# EAGLE design STM32F303CBT6_BTN8962TA_V1_0 (EAGLE 9.5.2)
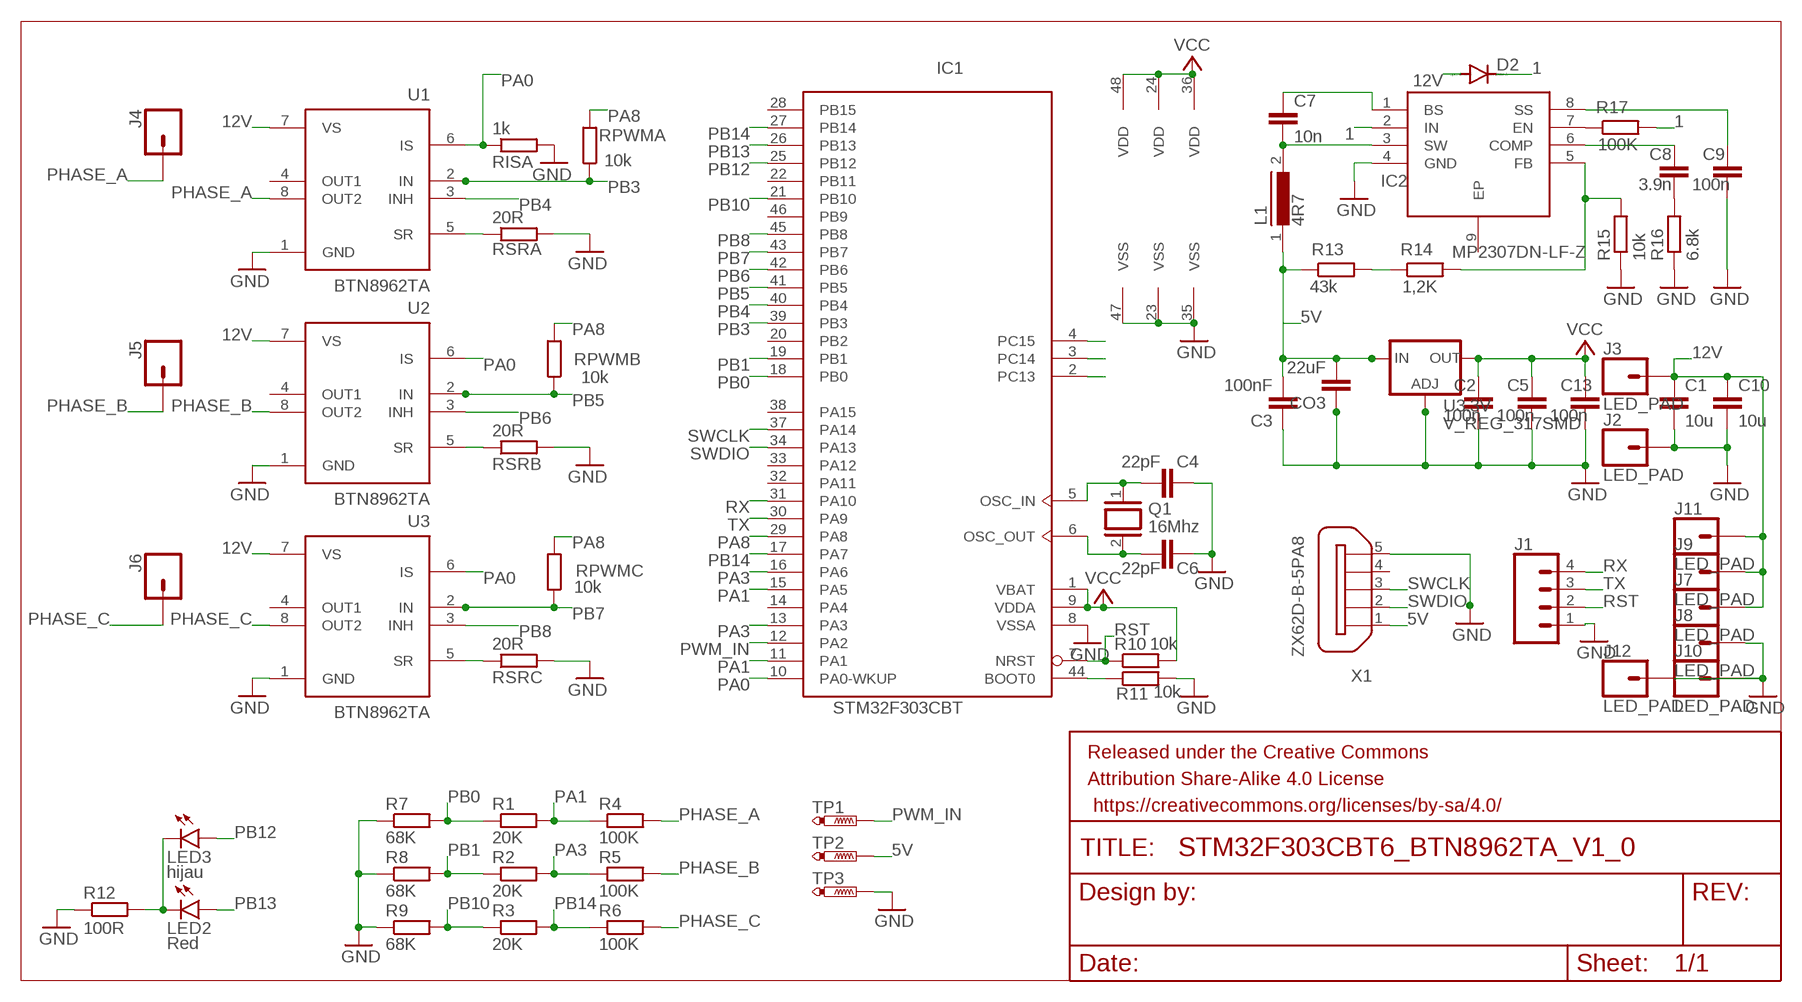
[diagram p0: schematic, sheet 1]

## Parts
C1  10u  C-EUC1206K  [C1206K]
C2  100n  C-EUC0603K  [C0603K]
C3  100nF  C-EUC0805  [C0805]
C4  22pF  C-EUC0805  [C0805]
C5  100n  C-EUC0603K  [C0603K]
C6  22pF  C-EUC0805  [C0805]
C7  10n  C-EUC0603K  [C0603K]
C8  3.9n  C-EUC0603K  [C0603K]
C9  100n  C-EUC0603K  [C0603K]
C10  10u  C-EUC1206K  [C1206K]
C13  100n  C-EUC0603K  [C0603K]
CO3  22uF  C-EUC0805  [C0805]
D2  DIODE-SOD80C  [SOD80C]
FRAME1  FRAME-LETTER  [CREATIVE_COMMONS]
IC1  STM32F303CBT  [LQFP48]
IC2  MP2307DN-LF-Z  [SOIC127P600X170-9N]
J1  CONN_04SMD2  [JST04_1MM_RA]
J2  LED_PAD  [CIRCULARPAD]
J3  LED_PAD  [CIRCULARPAD]
J4  CONN_01SNAP-MALE  [SNAP-MALE]
J5  CONN_01SNAP-MALE  [SNAP-MALE]
J6  CONN_01SNAP-MALE  [SNAP-MALE]
J7  LED_PAD  [CIRCULARPAD]
J8  LED_PAD  [CIRCULARPAD]
J9  LED_PAD  [CIRCULARPAD]
J10  LED_PAD  [CIRCULARPAD]
J11  LED_PAD  [CIRCULARPAD]
J12  LED_PAD  [CIRCULARPAD]
L1  4R7  DR74  [DR74]
LED2  Red  LEDCHIPLED_0805  [CHIPLED_0805]
LED3  hijau  LEDCHIPLED_0805  [CHIPLED_0805]
Q1  16Mhz  XTAL/S  [QS]
R1  20K  R-EU_R0805  [R0805]
R2  20K  R-EU_R0805  [R0805]
R3  20K  R-EU_R0805  [R0805]
R4  100K  R-EU_R0805  [R0805]
R5  100K  R-EU_R0805  [R0805]
R6  100K  R-EU_R0805  [R0805]
R7  68K  R-EU_R0805  [R0805]
R8  68K  R-EU_R0805  [R0805]
R9  68K  R-EU_R0805  [R0805]
R10  10k  R-EU_R0603  [R0603]
R11  10k  R-EU_R0603  [R0603]
R12  100R  R-EU_R0603  [R0603]
R13  43k  R-EU_R0603  [R0603]
R14  1,2K  R-EU_R0603  [R0603]
R15  10k  R-EU_R0603  [R0603]
R16  6.8k  R-EU_R0603  [R0603]
R17  100K  R-EU_R0603  [R0603]
RISA  1k  R-EU_R0805  [R0805]
RPWMA  10k  R-EU_R0805  [R0805]
RPWMB  10k  R-EU_R0805  [R0805]
RPWMC  10k  R-EU_R0805  [R0805]
RSRA  20R  R-EU_R0805  [R0805]
RSRB  20R  R-EU_R0805  [R0805]
RSRC  20R  R-EU_R0805  [R0805]
TP1  PTR1TP15SQ  [TP15SQ]
TP2  PTR1TP15SQ  [TP15SQ]
TP3  PTR1TP15SQ  [TP15SQ]
U1  BTN8962TA  [TO127P1500X440-8N-1]
U2  BTN8962TA  [TO127P1500X440-8N-1]
U3  BTN8962TA  [TO127P1500X440-8N-1]
U3.3V  V_REG_317SMD  [SOT223]
X1  ZX62D-B-5PA8  [ZX62D-B-5PA8]

## Nets
1: D2.C IC2.2(IN) R17.2
5V: C3.2 CO3.2 L1.1 R13.1 TP2.TP U3.3V.3(IN) X1.1
12V: C1.1 C10.1 D2.A J3.P$1 J3.P$2 J7.P$1 J7.P$2 J9.P$1 J9.P$2 J11.P$1 J11.P$2 U1.7(VS) U2.7(VS) U3.7(VS)
GND: C1.2 C2.2 C3.1 C4.1 C5.2 C6.1 C9.2 C10.2 C13.2 CO3.1 IC1.8(VSSA) IC1.23(VSS) IC1.35(VSS) IC1.47(VSS) IC2.4(GND) J1.1 J2.P$1 J2.P$2 J8.P$1 J8.P$2 J10.P$1 J10.P$2 J12.P$1 J12.P$2 R7.1 R8.1 R9.1 R11.2 R12.1 R15.1 R16.1 RISA.2 RSRA.2 RSRB.2 RSRC.2 TP3.TP U1.1(GND) U2.1(GND) U3.1(GND) U3.3V.1(ADJ) X1.5
N$1: C4.2 IC1.5(OSC_IN) Q1.1
N$3: RSRA.1 U1.5(SR)
N$4: C7.1 IC2.1(BS)
N$5: C7.2 IC2.3(SW) L1.2
N$6: C6.2 IC1.6(OSC_OUT) Q1.2
N$7: RSRB.1 U2.5(SR)
N$8: LED2.C LED3.C R12.2
N$9: RSRC.1 U3.5(SR)
N$10: IC1.44(BOOT0) R11.1
N$12: R13.2 R14.1
N$13: IC2.5(FB) R14.2 R15.2
N$14: C8.2 R16.2
N$15: C8.1 IC2.6(COMP)
N$16: IC2.7(EN) R17.1
N$17: IC1.4(PC15)
N$18: IC1.3(PC14)
N$19: IC1.2(PC13)
N$20: C9.1 IC2.8(SS)
PA0: IC1.10(PA0-WKUP) RISA.1 U1.6(IS) U2.6(IS) U3.6(IS)
PA1: IC1.11(PA1) IC1.15(PA5) R1.2 R4.1
PA3: IC1.13(PA3) IC1.16(PA6) R2.2 R5.1
PA8: IC1.29(PA8) RPWMA.2 RPWMB.2 RPWMC.2
PB0: IC1.18(PB0) R1.1 R7.2
PB1: IC1.19(PB1) R2.1 R8.2
PB3: IC1.39(PB3) RPWMA.1 U1.2(IN)
PB4: IC1.40(PB4) U1.3(INH)
PB5: IC1.41(PB5) RPWMB.1 U2.2(IN)
PB6: IC1.42(PB6) U2.3(INH)
PB7: IC1.43(PB7) RPWMC.1 U3.2(IN)
PB8: IC1.45(PB8) U3.3(INH)
PB10: IC1.21(PB10) R3.1 R9.2
PB12: IC1.25(PB12) LED3.A
PB13: IC1.26(PB13) LED2.A
PB14: IC1.17(PA7) IC1.27(PB14) R3.2 R6.1
PHASE_A: J4.2 R4.2 U1.8(OUT2)
PHASE_B: J5.2 R5.2 U2.8(OUT2)
PHASE_C: J6.2 R6.2 U3.8(OUT2)
PWM_IN: IC1.12(PA2) TP1.TP
RST: IC1.7(NRST) J1.2 R10.1
RX: IC1.31(PA10) J1.4
SWCLK: IC1.37(PA14) X1.3
SWDIO: IC1.34(PA13) X1.2
TX: IC1.30(PA9) J1.3
VCC: C2.1 C5.1 C13.1 IC1.1(VBAT) IC1.9(VDDA) IC1.24(VDD) IC1.36(VDD) IC1.48(VDD) R10.2 U3.3V.2(OUT)
Unconnected: IC1.14(PA4) IC1.20(PB2) IC1.22(PB11) IC1.28(PB15) IC1.32(PA11) IC1.33(PA12) IC1.38(PA15) IC1.46(PB9) IC2.9(EP) U1.4(OUT1) U2.4(OUT1) U3.4(OUT1) X1.4 X1.S1 X1.S2 X1.S3 X1.S4

## Library data of the parts
C1 C2 C5 C7-C10 C13 = rcl:C-EU: CAPACITOR, European symbol; SPICEPREFIX: C
C3 C4 C6 CO3 = rcl:C-EU: CAPACITOR, European symbol
D2 = diode:DIODE-: DIODE
FRAME1 = SparkFun-Aesthetics:FRAME-LETTER: Schematic Frame - Letter Standard 8.5x11 US Letter frame
IC1 = STM32F303x:STM32F303C*T: ARM 32-bit Cortex™-M3 CPU 72 MHz maximum frequency 128 to 256 Kbytes of Flash memory 32 to 40 kbytes of SRAM 37 GPIOs 2.0 to 3.6 V application supply; SPICEPREFIX: X
IC2 = MP2307DN-LF-Z:MP2307DN-LF-Z: Switching Voltage Regulators 3A/23VSynchRectified Step-down Converter Source: Datasheet <http://www.mouser.com/ds/2/277/MP2307_r1.9-371737.pdf>; ARROW_PART_NUMBER: MP2307DN-LF-Z; DESCRIPTION: Switching Voltage Regulators 3A/23VSynchRectified Step-down Converter; HEIGHT: 1.7mm; MANUFACTURER_NAME: Monolithic Power Systems (MPS); MANUFACTURER_PART_NUMBER: MP2307DN-LF-Z; MOUSER_PART_NUMBER: 946-MP2307DNLFZ; MOUSER_PRICE-STOCK: https://www.mouser.co.uk/ProductDetail/Monolithic-Power-Systems-MPS/MP2307DN-LF-Z?qs=rC7bBWoQAAmsFilkwcof5g%3D%3D
J1 = SparkFun-Connectors:CONN_04: Multi connection point. Often used as Generic Header-pin footprint for 0.1 inch spaced/style header connections On any of the 0.1 inch spaced packages, you can populate with these: Break Away Headers - Straight <https://www.sparkfun.com/products/116> (PRT-00116) Break Away Male Headers - Right Angle <https://www.sparkfun.com/products/553> (PRT-00553) Female Headers <https://www.sparkfun.com/products/115> (PRT-00115) Break Away Headers - Machine Pin <https://www.sparkfun.com/products/117> (PRT-00117) Break Away Female Headers - Swiss Machine Pin <https://www.sparkfun.com/products/743> (PRT-00743) For SCREWTERMINALS and SPRING TERMINALS visit here: Screw Terimnals on SparkFun.com <https://www.sparkfun.com/search/results?term=Screw+Terminals> (5mm/3.5mm/2.54mm spacing) This device is also useful as a general connection point to wire up your design to another part of your project. Our various solder wires solder well into these plated through hole pads. Hook-Up Wire - Assortment (Stranded, 22 AWG) <https://www.sparkfun.com/products/11375> (PRT-11375) Hook-Up Wire - Assortment (Solid Core, 22 AWG) <https://www.sparkfun.com/products/11367> (PRT-11367) View the entire wire category on our website here <https://www.sparkfun.com/categories/141> Special notes: Molex polarized connector foot print use with SKU : PRT-08231 with associated crimp pins and housings. 1MM SMD Version SKU: PRT-10208; PROD_ID: CONN-10310; SF_ID: PRT-10208
J2 J3 J7-J12 = SparkFun-Connectors:LED_PAD: LuMini 8X8 Solder Pad
J4-J6 = SparkFun-Connectors:CONN_01: Single connection point. Often used as Generic Header-pin footprint for 0.1 inch spaced/style header connections On any of the 0.1 inch spaced packages, you can populate with these: Break Away Headers - Straight <https://www.sparkfun.com/products/116> (PRT-00116) Break Away Male Headers - Right Angle <https://www.sparkfun.com/products/553> (PRT-00553) Female Headers <https://www.sparkfun.com/products/115> (PRT-00115) Break Away Headers - Machine Pin <https://www.sparkfun.com/products/117> (PRT-00117) Break Away Female Headers - Swiss Machine Pin <https://www.sparkfun.com/products/743> (PRT-00743) This device is also useful as a general connection point to wire up your design to another part of your project. Our various solder wires solder well into these plated through hole pads. Hook-Up Wire - Assortment (Stranded, 22 AWG) <https://www.sparkfun.com/products/11375> (PRT-11375) Hook-Up Wire - Assortment (Solid Core, 22 AWG) <https://www.sparkfun.com/products/11367> (PRT-11367) View the entire wire category on our website here <https://www.sparkfun.com/categories/141> Special notes: SMTSO-256-ET is a "flush mount" nut for a 4-40 screw. We mostly use this on specialty testbeds; it is a nice way to connect hardware to your PCB at an adjustable hieght. Also note, the SNAP packages are for using a snappable style connector. We sell a baggie of snaps and they are also used on two LilyPad designs: Snap Assortment - 30 pack (male and female) <https://www.sparkfun.com/products/11347> (DEV-11347) LilyPad Arduino SimpleSnap <https://www.sparkfun.com/products/10941> (DEV-10941) LilyPad SimpleSnap Protoboard <https://www.sparkfun.com/products/10940> (DEV-10940)
L1 = inductors:DR74: High Power Density, High Efficiency, Shielded Inductors Source: coiltronics_dr_series.pdf; SPICEPREFIX: L
LED2 LED3 = led:LED: LED OSRAM: - CHIPLED LG R971, LG N971, LY N971, LG Q971, LY Q971, LO R971, LY R971 LH N974, LH R974 LS Q976, LO Q976, LY Q976 LO Q996 - Hyper CHIPLED LW Q18S LB Q993, LB Q99A, LB R99A - SideLED LS A670, LO A670, LY A670, LG A670, LP A670 LB A673, LV A673, LT A673, LW A673 LH A674 LY A675 LS A676, LA A676, LO A676, LY A676, LW A676 LS A679, LY A679, LG A679 - Hyper Micro SIDELED® LS Y876, LA Y876, LO Y876, LY Y876 LT Y87S - SmartLED LW L88C, LW L88S LB L89C, LB L89S, LG L890 LS L89K, LO L89K, LY L89K LS L896, LA L896, LO L896, LY L896 - TOPLED LS T670, LO T670, LY T670, LG T670, LP T670 LSG T670, LSP T670, LSY T670, LOP T670, LYG T670 LG T671, LOG T671, LSG T671 LB T673, LV T673, LT T673, LW T673 LH T674 LS T676, LA T676, LO T676, LY T676, LB T676, LH T676, LSB T676, LW T676 LB T67C, LV T67C, LT T67C, LS T67K, LO T67K, LY T67K, LW E67C LS E67B, LA E67B, LO E67B, LY E67B, LB E67C, LV E67C, LT E67C LW T67C LS T679, LY T679, LG T679 LS T770, LO T770, LY T770, LG T770, LP T770 LB T773, LV T773, LT T773, LW T773 LH T774 LS E675, LA E675, LY E675, LS T675 LS T776, LA T776, LO T776, LY T776, LB T776 LHGB T686 LT T68C, LB T68C - Hyper Mini TOPLED® LB M676 - Mini TOPLED Santana® LG M470 LS M47K, LO M47K, LY M47K Source: http://www.osram.convergy.de LUXEON: - LUMILED® LXK2-PW12-R00, LXK2-PW12-S00, LXK2-PW14-U00, LXK2-PW14-V00 LXK2-PM12-R00, LXK2-PM12-S00, LXK2-PM14-U00 LXK2-PE12-Q00, LXK2-PE12-R00, LXK2-PE12-S00, LXK2-PE14-T00, LXK2-PE14-U00 LXK2-PB12-K00, LXK2-PB12-L00, LXK2-PB12-M00, LXK2-PB14-N00, LXK2-PB14-P00, LXK2-PB14-Q00 LXK2-PR12-L00, LXK2-PR12-M00, LXK2-PR14-Q00, LXK2-PR14-R00 LXK2-PD12-Q00, LXK2-PD12-R00, LXK2-PD12-S00 LXK2-PH12-R00, LXK2-PH12-S00 LXK2-PL12-P00, LXK2-PL12-Q00, LXK2-PL12-R00 Source: www.luxeon.com KINGBRIGHT: KA-3528ASYC Source: www.kingbright.com
Q1 = special:XTAL/S: CRYSTAL
R1-R17 RSRA RSRB RSRC = rcl:R-EU_: RESISTOR, European symbol; SPICEPREFIX: R
RISA RPWMA RPWMB RPWMC = rcl:R-EU_: RESISTOR, European symbol
TP1-TP3 = testpad:PTR1: TEST PIN
U1-U3 = BTN8962TA:BTN8962TA: BTN8962TA High Current PN Half Bridge NovalithIC TO127P1500X440-8N-1
U3.3V = SparkFun-PowerIC:V_REG_317: Voltage Regulator Standard LM317 adjustable voltage regulator. AOI (Adjust Output Input). Google 'LM317 Calculator' for easy to use app to get the two resistor values needed. 240/720 for 5V output. 240/390 for 3.3V output. Spark Fun Electronics SKU : COM-00527
X1 = zx62d-b-5pa8-oshpark_10:ZX62D-B-5PA8: Micro USB Type B Connector - Standard, Shell Through Hole Source: http://www.hirose.co.jp/cataloge_hp/ed_ZX_20140804.pdf; MF: Hirose; MPN: ZX62D-B-5PA8; OC_FARNELL: 2300438; OC_NEWARK: 69W0712

## Net classes
0 default: clearance 0.205 mm

## Board
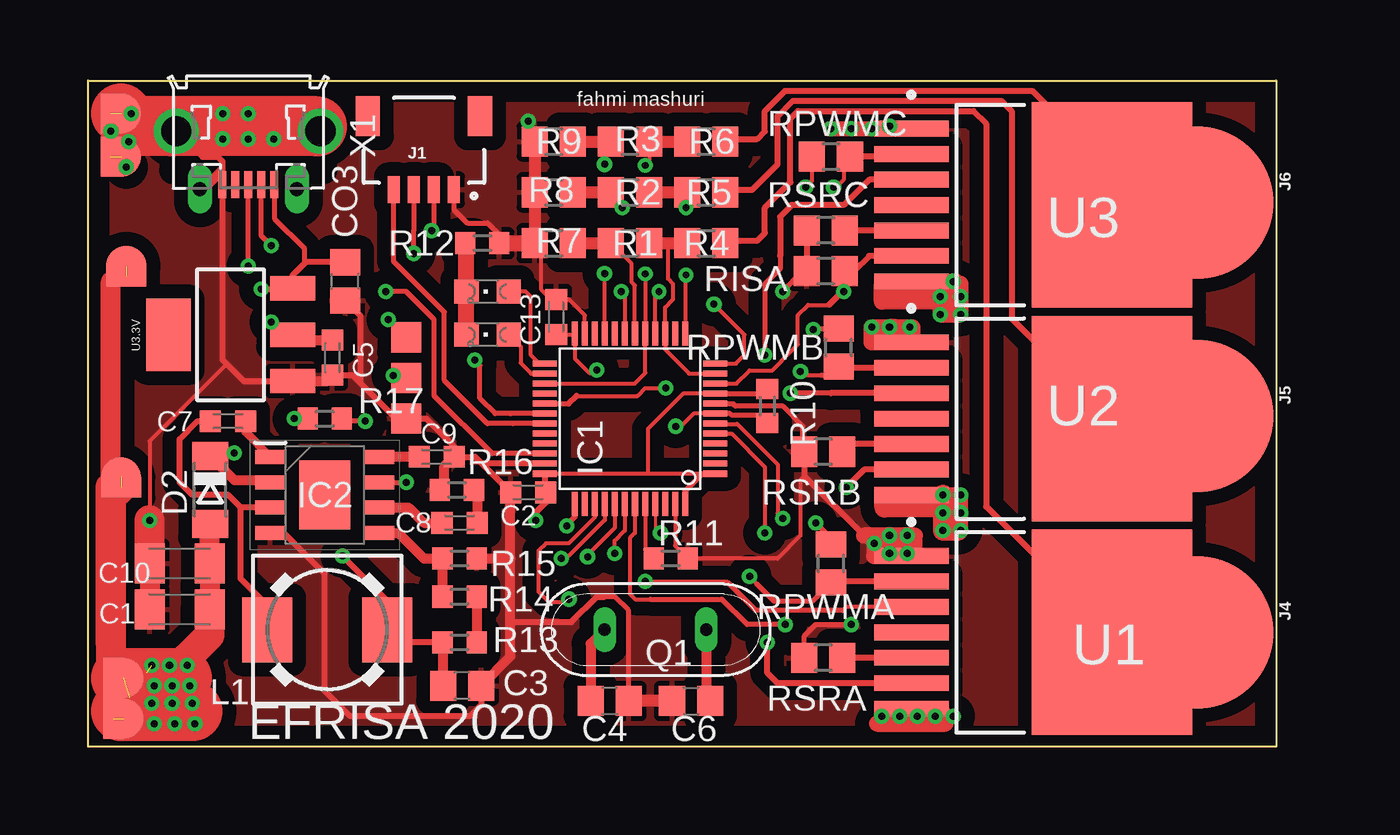
[diagram p1: board, top side]
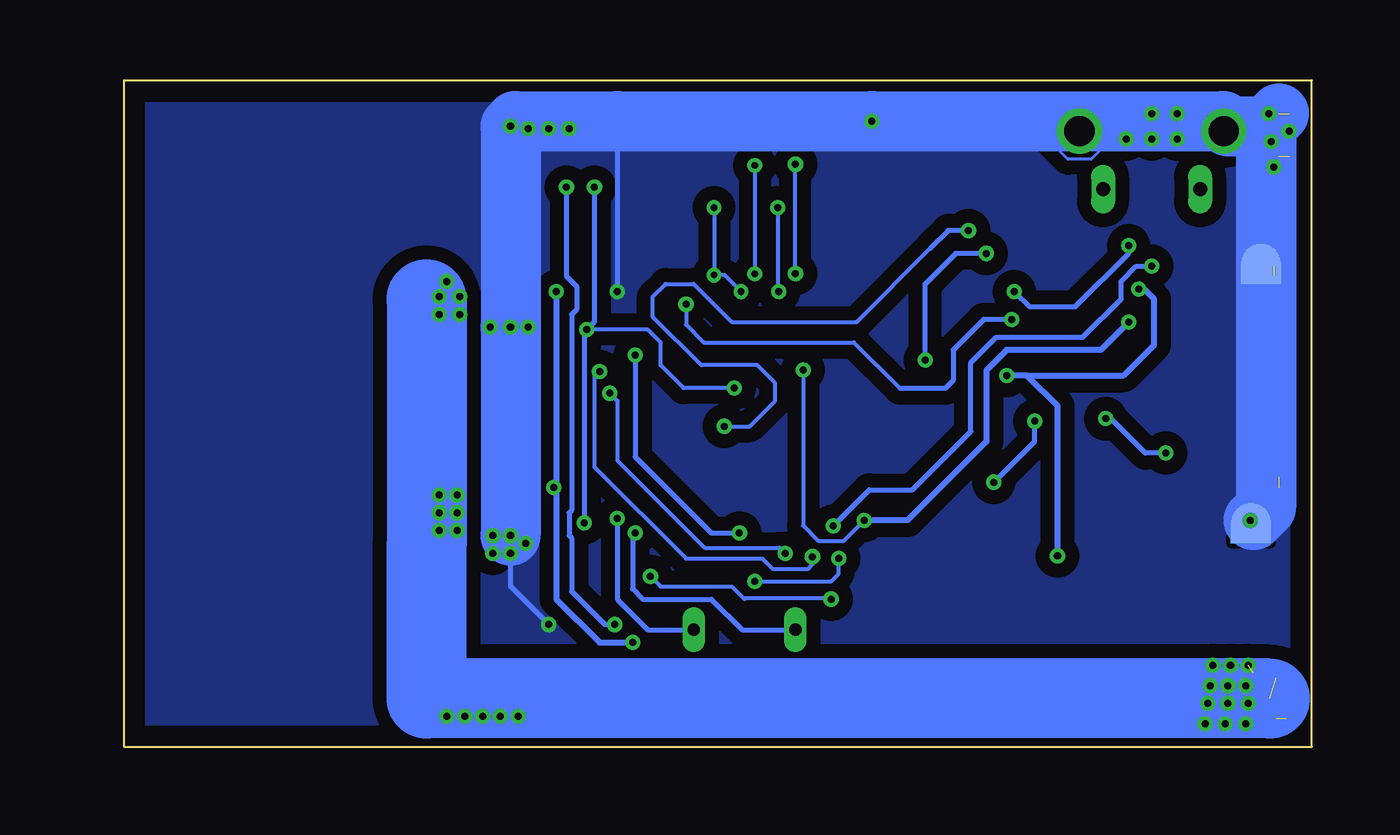
[diagram p2: board, bottom side, seen from below]

Size 59.31 x 33.27 mm. Coordinates in mm from the lower left corner, seen from the top.
Outline: 0,33.27 59.31,33.27 59.31,0 0,0 0,33.27
Copper layers (1*16): Top 0.035mm / dielectric 1.5mm / Bottom 0.035mm
Design rules "default *": minimum track width 6mil, minimum drill 0.35mm, track to track 6mil, track to pad 6mil, pad to pad 6mil, via to via 6mil, smd to smd 6mil, copper to edge 40mil, drill to drill 6mil, minimum pad ring 10mil, minimum via ring 8mil, stop-mask expansion 4mil, vias tented up to drill 0mil, thermal gap 10mil

### Footprints (pad centres in the part's own frame; a part is rotated, then mirrored left to right if it is on the bottom)
C1206K = smd 1.5 x 2: 1 -1.5,0; 2 1.5,0
C0603K = smd 1.05 x 1.08: 1 -0.875,0; 2 0.875,0
C0805 = smd 1.3 x 1.5: 1 -0.95,0; 2 0.95,0
SOD80C = smd 1.4 x 1.8: A 1.7,0; C -1.7,0
LQFP48 = smd 0.3 x 1.2: 1 -2.75,-4.25; 2 -2.25,-4.25; 3 -1.75,-4.25; 4 -1.25,-4.25; 5 -0.75,-4.25; 6 -0.25,-4.25; 7 0.25,-4.25; 8 0.75,-4.25; 9 1.25,-4.25; 10 1.75,-4.25; 11 2.25,-4.25; 12 2.75,-4.25; 25 2.75,4.25; 26 2.25,4.25; 27 1.75,4.25; 28 1.25,4.25; 29 0.75,4.25; 30 0.25,4.25; 31 -0.25,4.25; 32 -0.75,4.25; 33 -1.25,4.25; 34 -1.75,4.25; 35 -2.25,4.25; 36 -2.75,4.25 | smd 1.2 x 0.3: 13 4.25,-2.75; 14 4.25,-2.25; 15 4.25,-1.75; 16 4.25,-1.25; 17 4.25,-0.75; 18 4.25,-0.25; 19 4.25,0.25; 20 4.25,0.75; 21 4.25,1.25; 22 4.25,1.75; 23 4.25,2.25; 24 4.25,2.75; 37 -4.25,2.75; 38 -4.25,2.25; 39 -4.25,1.75; 40 -4.25,1.25; 41 -4.25,0.75; 42 -4.25,0.25; 43 -4.25,-0.25; 44 -4.25,-0.75; 45 -4.25,-1.25; 46 -4.25,-1.75; 47 -4.25,-2.25; 48 -4.25,-2.75
SOIC127P600X170-9N = smd 1.525 x 0.7: 1 -2.712,1.905; 2 -2.712,0.635; 3 -2.712,-0.635; 4 -2.712,-1.905; 5 2.712,-1.905; 6 2.712,-0.635; 7 2.712,0.635; 8 2.712,1.905 | smd 2.56 x 3.45: 9 0,0
JST04_1MM_RA = smd 0.6 x 1.35: 1 -1.5,0; 2 -0.5,0; 3 0.5,0; 4 1.5,0 | smd 1.2 x 2: NC1 2.8,-3.675; NC2 -2.8,-3.675
CIRCULARPAD = smd 2 x 2: P$1 0,0 | smd 2.007 x 1.016: P$2 0,-0.508
SNAP-MALE = smd 7.62 x 7.62: 2 0,0
DR74 = smd 2.5 x 3.25: 1 -3,0; 2 3,0
CHIPLED_0805 = smd 1.2 x 1.2: A 0,-1.05; C 0,1.05
QS = drill 0.61 long: 1 -2.54,0; 2 2.54,0
R0805 = smd 1.3 x 1.5: 1 -0.95,0; 2 0.95,0
R0603 = smd 1 x 1.1: 1 -0.85,0; 2 0.85,0
TP15SQ = smd 1.5 x 1.5: TP 0,0
TO127P1500X440-8N-1 = smd 3.708 x 0.787: 1 -5.004,3.81; 2 -5.004,2.54; 3 -5.004,1.27; 4 -5.004,0; 5 -5.004,-1.27; 6 -5.004,-2.54; 7 -5.004,-3.81 | smd 8.001 x 10.262: 8 5.004,0
SOT223 = smd 1.219 x 2.235: 1 -2.311,-3.099; 2 0,-3.099; 3 2.311,-3.099 | smd 3.6 x 2.2: 4 0,3.099
ZX62D-B-5PA8 = smd 1.35 x 0.4: 1 4.825,1.3; 2 4.825,0.65; 3 4.825,0; 4 4.825,-0.65; 5 4.825,-1.3 | drill 1.5: S1 2.15,-3.6; S2 2.15,3.6 | drill 0.7 long: S3 5.05,2.425; S4 5.05,-2.425

### Placement (x,y rotation side)
C1  4.57,6.86 180 top
C2  21.97,12.7 180 top
C3  18.67,3.05 180 top
C4  26.04,2.29 180 top
C5  12.19,19.43 270 top
C6  30.1,2.29 0 top
C7  6.99,16.26 180 top
C8  18.54,11.18 0 top
C9  17.4,14.48 0 top
C10  4.57,9.14 180 top
C13  23.37,21.46 90 top
CO3  12.83,23.24 90 top
D2  6.1,12.83 270 top
FRAME1  -1.27,-8.89 0 top  (outside the outline)
IC1  27.05,16.38 90 top
IC2  11.81,12.57 0 top
J1  16.76,27.81 180 top
J2  1.65,31.62 270 top
J3  1.78,3.43 270 top
J4  55.37,5.71 270 top
J5  55.37,16.51 270 top
J6  55.37,27.18 270 top
J7  1.65,13.46 0 top
J8  3.05,11.18 0 bottom
J9  1.78,1.4 270 top
J10  1.65,29.46 270 top
J11  1.91,24 0 top
J12  2.54,24.13 0 bottom
L1  11.94,5.84 180 top
LED2  19.94,20.57 90 top
LED3  19.94,22.73 90 top
Q1  28.32,5.84 0 top
R1  27.05,25.15 0 top
R2  27.05,27.69 0 top
R3  27.05,30.23 0 top
R4  30.86,25.15 0 top
R5  30.86,27.69 0 top
R6  30.86,30.23 0 top
R7  23.24,25.15 0 top
R8  23.24,27.69 0 top
R9  23.24,30.23 0 top
R10  33.91,17.02 90 top
R11  29.08,9.4 0 top
R12  19.68,25.15 180 top
R13  18.54,5.21 0 top
R14  18.54,7.49 180 top
R15  18.54,9.4 180 top
R16  18.41,12.83 0 top
R17  11.81,16.38 180 top
RISA  36.83,23.75 180 top
RPWMA  37.08,9.14 90 top
RPWMB  37.47,19.94 90 top
RPWMC  37.08,29.46 180 top
RSRA  36.7,4.45 180 top
RSRB  36.7,14.73 180 top
RSRC  36.83,25.78 180 top
TP1  15.88,20.45 90 top
TP2  15.88,18.41 90 top
TP3  15.88,16.38 90 top
U1  46.1,5.71 0 top
U2  46.1,16.38 0 top
U3  46.1,27.05 0 top
U3.3V  7.11,20.57 90 top
X1  8,32.89 270 top

### Tracks (layer width: path | path; a pad name or v marks a point on that pad's centre or on a via)
1  (via drill 0.35)
  Top 0.25: 6.75,13.87 6.75,14.5 7.11,14.86 v7.3,14.67 | v10.29,16.38 R17.2
  Top 0.5: IC2.2 9.1,13.3 7.32,13.3 6.75,13.87 D2.C
  Bottom 0.25: v7.3,14.67 8.32,14.67 10.03,16.38 v10.29,16.38
5V  (via drill 0.35)
  Top 0.25: X1.1 9.3,26.39 10.79,24.89 10.79,24.13
  Top 0.3: R13.1 15.57,5.21 L1.1 14.94,7.29 v12.7,9.53 | v15.24,18.54 15.75,18.54 TP2.TP | CO3.2 10.86,24.19 10.79,24.13 10.21,23.55 U3.3V.3 10.19,22.86 v8.64,22.86
  Top 0.5: C3.2 17.72,5.18 R13.1
  Bottom 0.3: v12.7,9.53 12.7,17.02 14.22,18.54 | 14.22,18.54 v15.24,18.54 | 14.22,18.54 9.4,18.54 7.87,20.07 7.87,22.35 8.38,22.86 v8.64,22.86
12V  (via drill 0.35)  (5 unrouted)
  Top 0.3: v43.18,1.52 42.8,1.91 U1.7
  Top 0.5: 2.67,3.43 2.92,3.68
  Top 0.8: U2.7 42.67,12.57 v43.56,11.68 | U3.7 42.55,23.24 | 42.55,23.24 v43.18,23.24 | 42.55,23.24 v42.55,21.59 v43.56,21.59 v43.56,22.48 43.56,23.11 43.43,23.11 43.31,23.24 43.05,22.99 43.05,22.23 39.62,22.23 39.62,23.11 40.01,22.73 42.04,22.73
  Top 1: v3.17,4.06 2.54,3.43 J3.P$2 1.27,4.7 0.89,5.08 0.89,13.08 | C1.1 C10.1 6.07,11.1 D2.A | 1.14,11.43 1.14,23.24 J11.P$1
  Top 1.5: C1.1 6.07,5.56 3.94,3.43 J3.P$1 J3.P$2 1.14,3.56 1.14,11.43 1.14,12.45 J7.P$2
  Top 2: J3.P$1 J9.P$1
  Bottom 0.3: 44.2,2.41 43.31,1.52 v43.18,1.52
  Bottom 0.5: v3.17,4.06 3.61,3.63 5.91,3.63 5.91,3.17
  Bottom 0.8: v43.56,11.68 44.2,11.05 44.2,10.03 | v43.18,23.24 44.07,22.35 44.2,22.35
  Bottom 4: 2.1,2.41 44.2,2.41 44.2,10.03 44.2,22.35
GND  (via drill 0.35)  (2 unrouted)
  Top 0.2: 1.78,29.59 2.97,30.78 2.97,31.34 | 4.15,32.17 3.81,32.17 2.97,31.34 | 2.97,31.34 2.62,30.99 2.29,30.99 | 35.69,16 35.63,16.06 35.63,14.86 RSRB.2 | IC1.23 24.8,21.55 24.02,22.34 C13.2 23.13,22.34 22.61,22.86 22.61,24.83 R7.1 | 29.34,12.17 IC1.47 29.3,10.03 R11.2 34.42,9.4 35.56,10.54 35.56,13.33 35.75,13.52 | 6.92,19.11 3.07,15.26 v3.07,11.3
  Top 0.25: IC1.8 32.19,17.13 32.32,17.01 34.68,17.01 35.69,16 | 35.69,15.37 35.75,15.3 RSRB.2 | C4.1 26.98,6.8 26.29,7.49 25.78,7.49 | RSRA.2 35.75,5.53 36.32,6.1 v38.1,6.1 | v34.67,22.73 35.69,23.75 RISA.2 | X1.5 6.73,28.04 | J10.P$1 1.78,29.59 | J1.1 18.26,26.82 18.92,26.16 19.94,26.16 20.54,25.57 R12.1
  Top 0.3: RSRC.2 RISA.2 | U3.1 40.97,30.99 40.13,30.99 v40.01,30.99 | RSRB.2 35.75,13.52 38.73,10.54 | 19.66,14.13 19.32,14.48 C9.2 18.27,15 16.89,16.38 TP3.TP 15.37,16.38 13.59,18.16 | 19.66,14.13 C2.2 | IC1.35 19.66,14.13 | C5.2 13.19,18.56 13.59,18.16 | C3.1 19.62,2.09 19.05,1.52 13.08,1.52 11.81,2.79 11.81,8.64 9.78,10.67 IC2.4 | U3.3V.1 7.77,18.26 6.92,19.11 6.7,19.33 X1.5 6.7,29.24 6.48,29.46 5.71,29.46 v4.19,30.99 | CO3.1 13.59,21.53 13.59,18.16 | 25.78,7.49 25.4,7.49 24.13,6.22 21.08,6.22 | R9.1 21.97,30.55 v21.97,31.24
  Top 0.5: 36.96,30.99 40.13,30.99 | R16.1 17.78,13.04 17.78,13.98 C9.2 | C3.1 21.08,4.51 21.08,6.22 21.08,9.4 | C2.2 21.08,12.69 21.08,9.4 | R15.1 21.08,9.4 | U3.3V.1 11.9,18.26 C5.2
  Top 0.6: R9.1 R8.1 R7.1 | C6.1 C4.1
  Top 0.8: v40.01,10.54 39.5,10.03 39.5,9.53 40.89,9.53 | U1.1 40.89,9.53 | 40.89,9.53 v40.89,10.54 39.62,10.54 v39.24,10.16 39.75,9.65 v40.01,9.65 40.13,9.65 40.39,9.91 41.02,9.91 41.27,9.65 41.27,10.54 38.99,10.54 | 38.99,10.54 38.73,10.54 | 38.99,10.54 39.24,10.29 39.24,9.53 | U2.1 40.34,20.95 v40.01,20.95 | R12.1 R7.1
  Top 1: C10.2 C1.2
  Top 1.5: C10.2 v3.07,11.3
  Top 2: J2.P$1 J10.P$1
  Top 3: J2.P$1 2.29,30.99 v4.19,30.99 11.43,30.99
  Bottom 0.25: v38.1,6.1 40.01,8 v40.01,10.54 | 34.67,31.24 v34.67,22.73
  Bottom 1: J12.P$1 2.29,24.38 2.29,27.87
  Bottom 1.5: v4.19,30.99 3.05,29.84 J8.P$1
  Bottom 3: v40.01,10.54 v40.01,20.95 v40.01,30.99 39.75,31.24 34.67,31.24 v21.97,31.24 4.45,31.24 v4.19,30.99 2.29,30.99 | 2.29,30.99 J2.P$1 | 2.29,30.99 2.29,27.87 2.29,11.94 2.92,11.3
  pour Top (isolate 0.7): 0,33.27 59.31,33.27 59.31,0 0,0
  pour Bottom (isolate 0.7): 0,33.27 59.31,33.27 59.31,0 0,0
N$1  (via drill 0.35 pad 0.2)
  Top 0.2: IC1.5 32.12,15.63 33.78,13.97 v33.78,10.67
  Top 0.5: Q1.1 25.09,5.15 C4.2
  Bottom 0.25: v33.78,10.67 33.91,10.54 33.91,7.87 33.4,7.37 29.97,7.37 28.45,5.84 Q1.1
N$2  (via drill 0.35)
  Bottom 0.152: 13.34,30.99 13.01,30.66 13.01,30.16 12.18,29.34 11.02,29.34 10,30.35 v9.27,30.35
N$3
  Top 0.3: U1.5 RSRA.1
N$4
  Top 0.4: IC2.1 7.86,15.72 C7.1
N$5
  Top 0.3: IC2.3 7.62,11.94 | C7.2 5.46,16.26 4.57,15.37 4.57,13.21 5.21,12.57 6.99,12.57 7.62,11.94 | L1.2 8.94,7.06 7.62,8.38 7.62,11.94
N$6  (via drill 0.35 pad 0.2)
  Top 0.2: IC1.6 31.32,16.12 32.4,16.12 34.42,14.1 34.42,11.66 v34.67,11.4
  Top 0.5: Q1.2 30.86,2.47 C6.2
  Bottom 0.25: v34.67,11.4 34.67,7.37 33.15,5.84 Q1.2
N$7
  Top 0.3: U2.5 38.03,15.11 RSRB.1
N$8
  Top 0.8: LED2.C LED3.C 18.89,25.09 R12.2
N$9
  Top 0.3: U3.5 RSRC.1
N$10
  Top 0.2: IC1.44 27.8,9.83 R11.1
N$11  (via drill 0.35)
  other vias: 6.73,30.35
N$12
  Top 0.5: R14.1 R13.2
N$13
  Top 0.5: R14.2 R15.2 16.76,9.4 15.49,10.67 IC2.5
N$14
  Top 0.5: R16.2 19.42,12.68 C8.2
N$15
  Top 0.5: IC2.6 16,11.94 16.76,11.18 C8.1
N$16  (via drill 0.35)
  Top 0.152: IC2.7 14.4,13.34 13.84,13.34
  Top 0.25: IC2.7 v15.88,13.21 | v13.84,16.26 12.79,16.26 R17.1
  Bottom 0.25: v15.88,13.21 13.84,15.24 v13.84,16.26
N$20
  Top 0.5: C9.1 IC2.8
N$21  (via drill 0.35)
  other vias: 6.73,31.62
N$22  (via drill 0.35)
  other vias: 8,31.62
N$23  (via drill 0.35)
  other vias: 37.08,30.86
N$24  (via drill 0.35)
  other vias: 8,30.35
N$25
  Top 3: 1.65,1.78 5.21,1.78
N$26
  Top 3: 1.65,3.43 4.7,3.43
N$27  (via drill 0.35)
  other vias: 38.1,30.86
N$28  (via drill 0.35)
  other vias: 4.06,4.06
N$29  (via drill 0.35)
  other vias: 4.95,4.06
N$30  (via drill 0.35)
  other vias: 3.3,3.05
N$31  (via drill 0.35)
  other vias: 4.19,3.05
N$32  (via drill 0.35)
  other vias: 5.08,3.05
N$33  (via drill 0.35)
  other vias: 3.17,2.16
N$34  (via drill 0.35)
  other vias: 4.19,2.16
N$35  (via drill 0.35)
  other vias: 5.21,2.16
N$36  (via drill 0.35)
  other vias: 3.3,1.14
N$37  (via drill 0.35)
  other vias: 4.32,1.14
N$38  (via drill 0.35)
  other vias: 5.33,1.14
N$39  (via drill 0.35)
  other vias: 39.12,30.86
N$40
  Top 0.5: 36.96,30.73 39.62,30.73
N$41  (via drill 0.35)
  other vias: 39.62,1.52
N$42  (via drill 0.35)
  other vias: 40.51,1.52
N$43  (via drill 0.35)
  other vias: 41.4,1.52
N$44  (via drill 0.35)
  other vias: 42.29,1.52
N$45
  Top 0.8: 39.37,1.14 42.8,1.14
N$46  (via drill 0.35)
  other vias: 43.56,12.57
N$47  (via drill 0.35)
  other vias: 42.67,11.68
N$48  (via drill 0.35)
  Top 1: v42.67,12.57 v42.67,10.79 43.43,10.79 43.43,12.45 42.8,12.45 42.29,11.94 39.75,11.94 39.75,12.32
N$49  (via drill 0.35)
  other vias: 42.55,22.48
N$50  (via drill 0.35)
  other vias: 43.56,10.79
N$51  (via drill 0.35)
  other vias: 2.16,31.62
N$52  (via drill 0.35)
  other vias: 40.89,9.65
N$53  (via drill 0.35)
  Top 0.8: 41.15,20.95 41.15,20.19 39.12,20.19 v39.12,20.95 v41.02,20.95
N$54  (via drill 0.35)
  other vias: 2.03,30.23
N$55  (via drill 0.35)
  other vias: 1.91,28.96
N$56  (via drill 0.35)
  other vias: 1.14,30.73
N$57
  Top 0.5: 5.46,27.81 5.71,27.81 6.6,28.7
PA0  (via drill 0.35)
  Top 0.2: 35.93,22.06 35.94,22.06 | 35.94,22.06 36.98,22.06 | 35.94,22.06 35.43,21.55 35.43,20.09 34.62,19.28 34.62,19.26 34.16,18.8 33.02,18.8 32.36,18.13 IC1.10
  Top 0.3: U3.6 38.99,24.51 38.23,23.75 RISA.1 | U2.6 38.73,13.84 v37.85,12.95 | U1.6 34.42,3.17 33.91,3.68 v33.91,5.21 | RISA.1 37.78,22.79 v37.72,22.73 | RISA.1 37.78,22.86 36.98,22.06
  Bottom 0.3: v37.72,22.73 37.72,13.08 v37.85,12.95 37.72,12.83 37.72,7.37 35.56,5.21 v33.91,5.21
PA1
  Top 0.2: 28.8,25.12 28.83,25.15 | 29.08,25.15 28.96,25.02 28.96,23.37 29.21,23.11 29.21,22.35 28.8,21.94 IC1.15 28.8,19.84 30.01,18.63 IC1.11
  Top 0.6: R1.2 28.83,25.15 29.08,25.15 R4.1
PA3  (via drill 0.33, 0.33 pad 0.2)
  Top 0.2: R5.1 29.91,26.99 v29.84,26.92 | v29.84,23.56 29.8,23.52 IC1.13 | IC1.16 28.3,22.54 v28.5,22.73
  Top 0.6: R2.2 R5.1
  Bottom 0.2: v29.84,26.92 v29.84,23.56 29.32,23.56 v28.5,22.73
PA8  (via drill 0.35, 0.35 pad 0.2)
  Top 0.2: RPWMC.2 36.13,28.26 v35.81,27.94 | v28.83,17.91 27.81,17.91 27.43,17.53 24.38,17.53
  Top 0.25: RPWMA.2 37.08,10.41 v36.32,11.18 | v36.2,20.83 36.2,20.89 RPWMB.2 | IC1.29 23.99,17.13
  Top 0.3: 23.99,17.13 24.38,17.53
  Bottom 0.2: v28.83,17.91 31.37,17.91 32.51,19.05 32.51,20.19 33.15,20.83 v36.2,20.83
  Bottom 0.25: v36.32,11.18 36.32,20.7 v36.2,20.83 35.81,21.21 v35.81,27.94
PB0
  Top 0.2: IC1.18 27.3,23.04 27.13,23.21 27.13,24.12 R1.1
  Top 0.6: R7.2 R1.1
PB1  (via drill 0.35 pad 0.2)
  Top 0.2: R2.1 26.1,27.49 v26.67,26.92 | v26.62,22.73 26.8,22.55 IC1.19
  Top 0.6: R8.2 R2.1
  Bottom 0.2: v26.67,26.92 26.67,22.79 v26.62,22.73
PB3  (via drill 0.35)
  Top 0.2: IC1.39 25.3,11.46 24,10.16 22.86,10.16 22.48,9.78 22.48,7.75 22.99,7.24 23.88,7.24 v24,7.37 | 33.71,7.8 33.02,8.49 v33.02,8.51
  Top 0.25: RPWMA.1 36.15,7.26 34.25,7.26 33.71,7.8 33.38,8.13
  Top 0.3: U1.2 37.15,8.26 RPWMA.1
  Bottom 0.2: v33.02,8.51 32.51,8 28.96,8 28.38,7.43 | 28.38,7.43 28.32,7.37 | 28.38,7.43 24.07,7.43 v24,7.37
PB4  (via drill 0.35)
  Top 0.2: U1.3 37.85,6.99 37.66,6.8 | IC1.40 25.8,11.32 23.88,9.4 v23.62,9.4 | 27.69,8.2 27.69,8.26 v27.81,8.26
  Top 0.25: 37.66,6.8 33.33,6.8 31.93,8.2 27.69,8.2
  Bottom 0.2: v27.81,8.26 24,8.26 23.62,8.64 v23.62,9.4
PB5  (via drill 0.35, 0.35 pad 0.2)
  Top 0.2: 36.58,18.54 35.76,18.54 v35.56,18.74 | IC1.41 26.3,10.93 24.89,9.53 v24.93,9.49
  Top 0.25: RPWMB.1 37.02,18.54 36.58,18.54
  Top 0.3: U2.2 37.53,18.92 RPWMB.1
  Bottom 0.2: v35.56,18.74 35.81,18.49 35.81,13.97 31.24,9.4 27.43,9.4 26.92,8.89 25.15,8.89 24.93,9.11 v24.93,9.49
PB6  (via drill 0.35, 0.35 pad 0.2)
  Top 0.2: IC1.42 26.8,10.8 26.29,10.29 v26.29,9.65
  Top 0.25: 37.08,17.65 v35.05,17.65
  Top 0.3: U2.3 37.08,17.65
  Bottom 0.2: v35.05,17.65 34.67,17.27 34.67,14.29 30.31,9.93 26.57,9.93 v26.29,9.65
PB7  (via drill 0.35, 0.35 pad 0.2)
  Top 0.2: RPWMC.1 37.72,29.15 37.72,28.32 37.34,27.94 v37.21,27.94 | 28.07,7.37 27.3,7.37 27.05,7.62 27.05,10.41 27.3,10.66 IC1.43
  Top 0.25: v34.8,6.1 32.89,6.1 31.62,7.37 28.07,7.37
  Top 0.3: U3.2 40.97,29.46 RPWMC.1 37.66,29.46
  Bottom 0.25: v37.21,27.94 37.21,23.5 36.7,22.99 36.7,21.84 36.96,21.59 36.96,11.81 37.08,11.68 37.08,10.54 36.96,10.41 36.96,7.75 35.31,6.1 v34.8,6.1
PB8  (via drill 0.35)
  Top 0.152: IC1.45 28.32,12.11 28.32,10.92 v28.57,10.67
  Top 0.25: 34.54,24.51 34.54,23.88 33.78,23.11 v33.78,19.56
  Top 0.3: U3.3 38.99,28.32 37.72,27.05 35.12,27.05 34.54,26.47 34.54,24.51
  Bottom 0.25: v33.78,19.56 33.78,14.48 29.97,10.67 v28.57,10.67
PB10  (via drill 0.35 pad 0.2)
  Top 0.2: IC1.21 25.8,23.6 v25.78,23.62 | v25.78,29.08 25.78,29.91 R3.1
  Top 0.6: R9.2 R3.1
  Bottom 0.2: v25.78,23.62 v25.78,29.08 25.78,29.21
PB12
  Top 0.2: IC1.25 22.52,19.13 22.1,19.56 22.1,22.48 21.84,22.73 LED3.A
PB13
  Top 0.2: LED2.A 21.59,19.97 21.59,19.16 22.12,18.63 IC1.26
PB14  (via drill 0.33 pad 0.2)
  Top 0.2: R3.2 28,29.03 v27.81,29.03 | v27.81,23.62 27.81,20.64 IC1.17 27.81,20.62 27.81,18.67 27.28,18.13 IC1.27
  Top 0.6: R3.2 R6.1
  Bottom 0.2: v27.81,29.03 v27.81,23.62
PHASE_A
  Top 0.3: R4.2 31.94,25.27 33.4,25.27 33.78,25.65 33.78,26.92 35.05,28.19 35.05,31.37 35.43,31.75 44.2,31.75 44.83,31.11 44.83,11.99 U1.8
  Top 0.5: J4.2 55.75,5.71 56.26,6.22 56.9,5.59 56.26,4.95 55.5,5.71 U1.8
PHASE_B
  Top 0.3: R5.2 31.94,27.81 33.15,27.81 34.42,29.08 34.42,31.5 35.18,32.26 45.59,32.26 46.1,31.75 46.1,21.39 U2.8
  Top 0.5: U2.8 56.26,16.38 56.13,16.51 J5.2
PHASE_C
  Top 0.3: R6.2 31.94,30.35 33.4,30.35 33.78,30.73 33.78,31.75 34.8,32.76 47.12,32.76 52.07,27.81 52.07,26.8 51.94,26.67 51.49,26.67 U3.8
  Top 0.5: U3.8 55.5,27.05 56.26,27.81 56.01,27.81 J6.2
PWM_IN  (via drill 0.35)
  Top 0.2: IC1.12 32.34,19.13 32.77,19.56 32.77,20.57 v31.24,22.1
  Top 0.25: TP1.TP v14.99,21.34
  Bottom 0.2: v31.24,22.1 31.24,21.08 30.35,20.19 22.86,20.19 20.57,17.91
  Bottom 0.25: v14.99,21.34 16.38,21.34 17.91,19.81 17.91,18.29 18.29,17.91 20.57,17.91
RST  (via drill 0.35)
  Top 0.2: IC1.7 30.22,16.63 29.59,16 v29.34,16
  Top 0.25: IC1.7 32.05,16.63 32.13,16.55 33.53,16.55 R10.1 | J1.2 17.26,25.9 v17.14,25.78
  Bottom 0.2: v29.34,16 28.07,16 26.8,17.27 26.8,18.16 27.69,19.05 30.48,19.05 32.89,21.46 32.89,22.48 32.26,23.11 30.86,23.11 28.96,21.21 22.73,21.21 19.05,24.89
  Bottom 0.25: v17.14,25.78 18.16,25.78 19.05,24.89
RX
  Top 0.25: IC1.31 21.21,16.13 | 21.21,16.13 | J1.4 15.24,27.79 15.24,24.26 17.78,21.72 17.78,18.29 19.93,16.13 21.21,16.13
SWCLK  (via drill 0.35)
  Top 0.25: IC1.37 24.3,11.47 23.88,11.05 v23.9,11.02 | v8,24 X1.3
  Bottom 0.25: v23.9,11.02 22.1,12.83 19.94,12.83 17.02,15.75 17.02,19.18 15.75,20.45 11.43,20.45 9.53,22.35 9.53,23.24 8.76,24 v8,24
SWDIO  (via drill 0.35)
  Top 0.25: IC1.34 20.16,14.63 17.27,17.53 17.27,21.34 15.88,22.73 v14.86,22.73 | v9.14,25.02 8.64,25.53 8.64,28.05 X1.2
  Bottom 0.25: v14.86,22.73 14.1,21.97 11.81,21.97 9.14,24.64 v9.14,25.02
TX  (via drill 0.35)
  Top 0.25: IC1.30 21.09,16.63 21.08,16.64 20.32,16.64 19.56,17.4 19.56,19.05 v19.3,19.3 | J1.3 16.26,25.79 16.26,25.78 v16.26,24.64
  Bottom 0.25: v16.26,24.64 17.78,24.64 19.3,23.11 v19.3,19.3
VCC  (via drill 0.35)
  Top 0.2: IC1.1 27.94,13.63 | 27.94,13.63 IC1.36 | IC1.9 29.7,17.63 27.94,15.88 27.94,13.63 | C13.1 24.26,20.59 IC1.24 24.3,19.39 25.02,18.67 25.4,18.67 v25.4,18.82
  Top 0.25: IC1.9 33.63,17.63 33.87,17.87 R10.2 | IC1.1 30.65,13.63 29.8,12.78 IC1.48
  Top 0.3: IC1.36 22.8,12.74 C2.1 22.85,12.19 22.35,11.7 v22.35,11.3 | U3.3V.2 9.78,20.57 v9.14,21.21
  Top 0.5: U3.3V.2 10.48,20.31 C5.1
  Bottom 0.2: v25.4,18.82 25.4,11.05 24.64,10.29 23.37,10.29 v22.35,11.3
  Bottom 0.3: v9.14,21.21 10.54,19.81 15.24,19.81 16.26,18.8 16.26,15.24 20.19,11.3 v22.35,11.3

### Text on the board
tPlace: fahmi mashuri
tNames: EFRISA 2020